# EAGLE design daq (EAGLE 9.6.2)
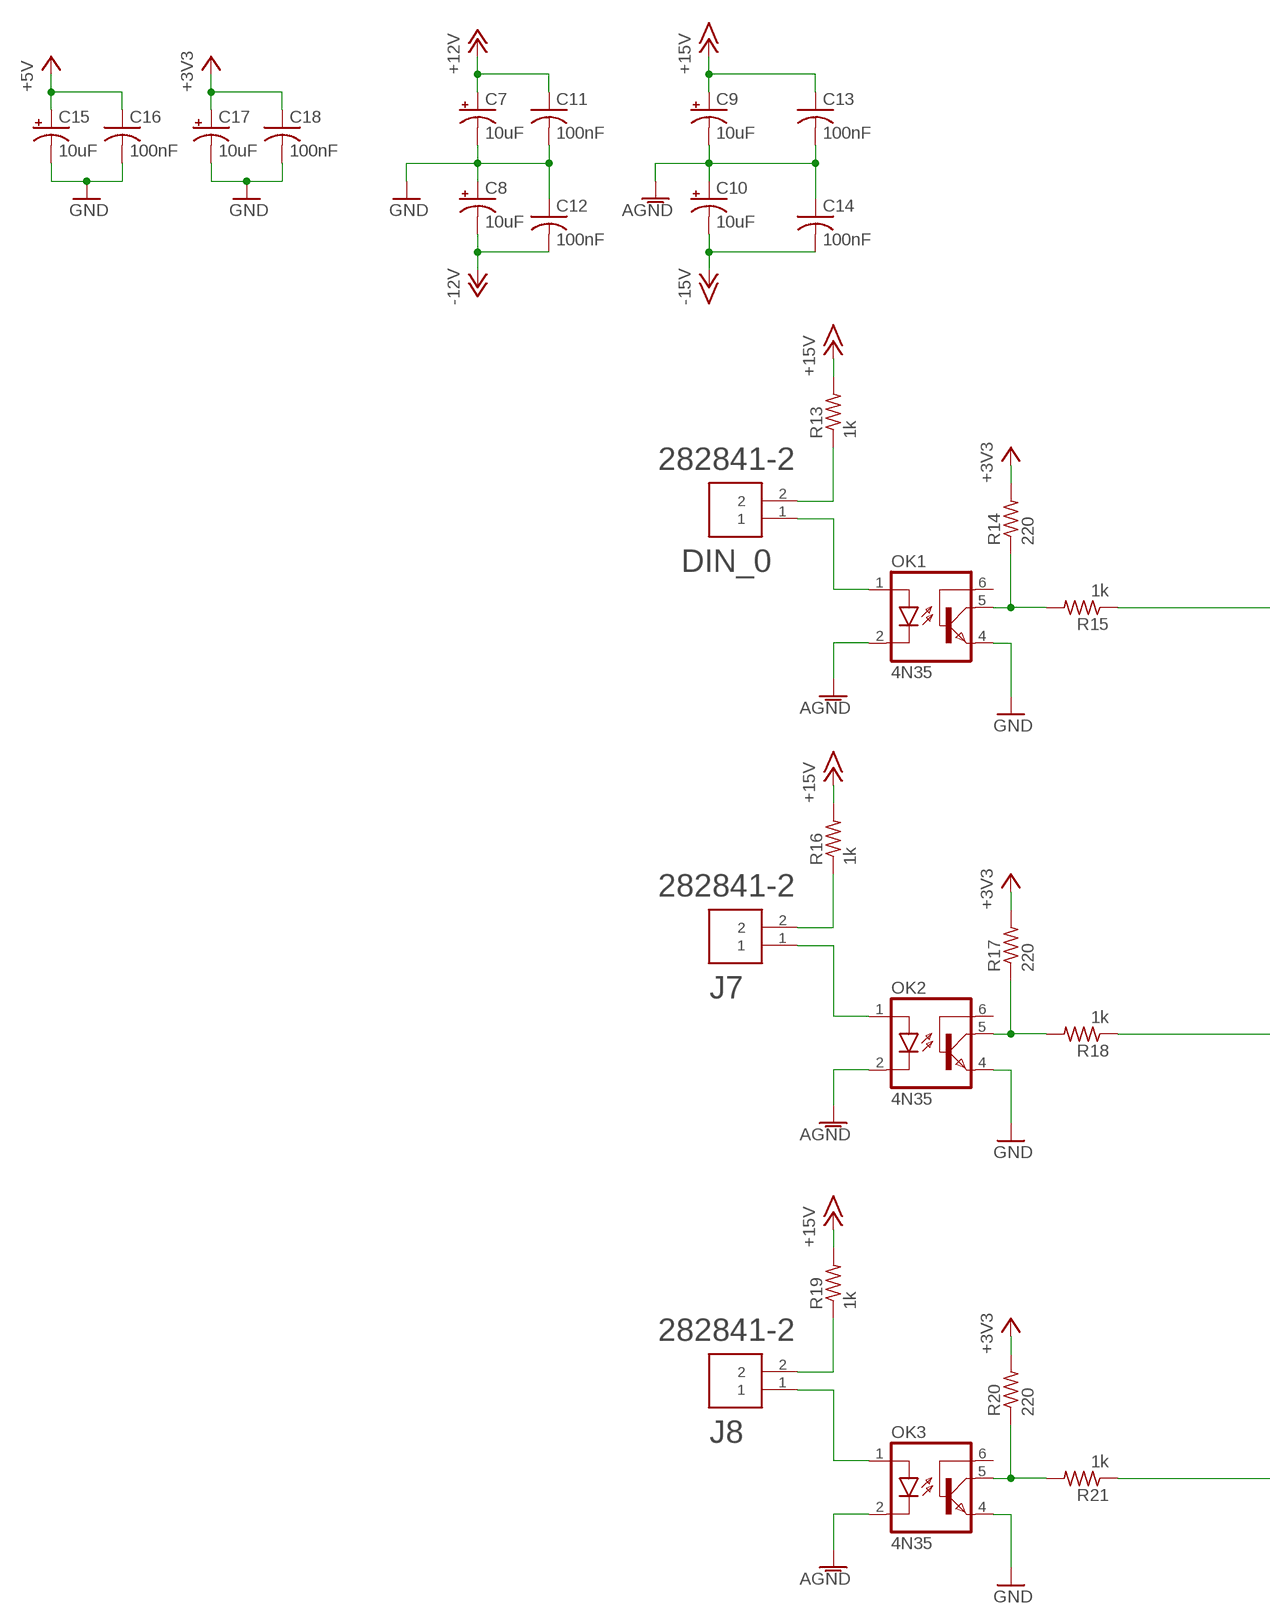
[diagram p0: schematic, sheet 1, part 1 of 2]
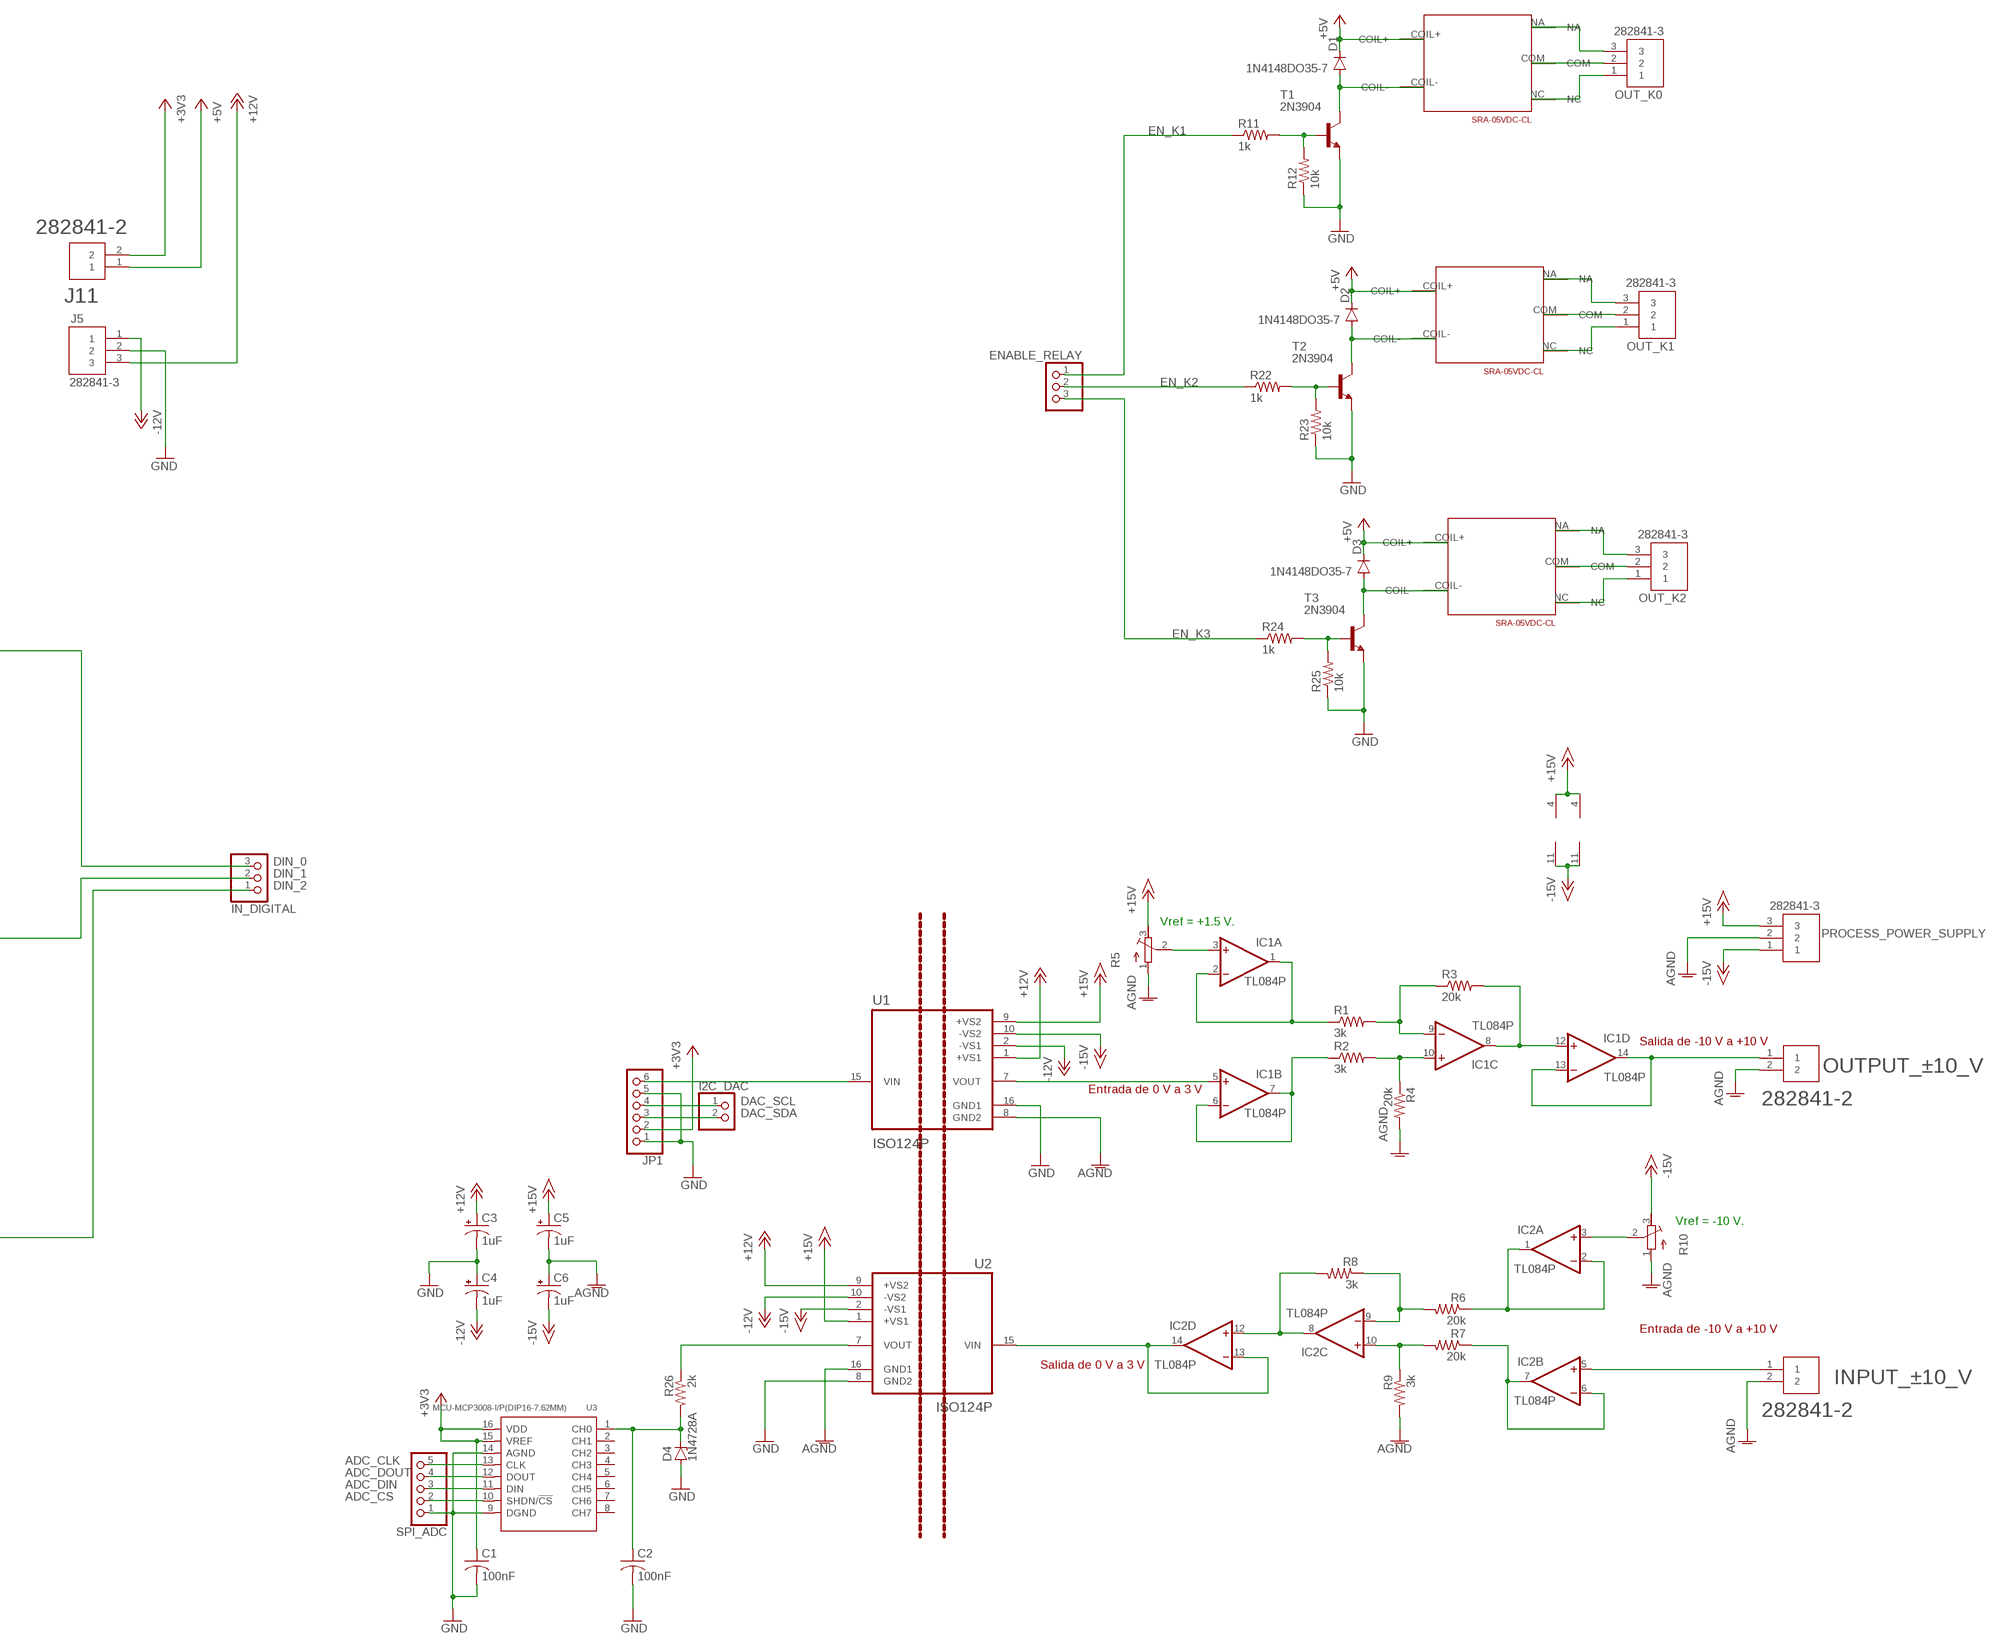
[diagram p1: schematic, sheet 1, part 2 of 2]

## Parts
C1  100nF  C-US025-025X050  [C025-025X050]
C2  100nF  C-US025-025X050  [C025-025X050]
C3  1uF  CPOL-USE2-5  [E2-5]
C4  1uF  CPOL-USE2-5  [E2-5]
C5  1uF  CPOL-USE2-5  [E2-5]
C6  1uF  CPOL-USE2-5  [E2-5]
C7  10uF  CPOL-USE2-5  [E2-5]
C8  10uF  CPOL-USE2-5  [E2-5]
C9  10uF  CPOL-USE2-5  [E2-5]
C10  10uF  CPOL-USE2-5  [E2-5]
C11  100nF  C-US025-025X050  [C025-025X050]
C12  100nF  C-US025-025X050  [C025-025X050]
C13  100nF  C-US025-025X050  [C025-025X050]
C14  100nF  C-US025-025X050  [C025-025X050]
C15  10uF  CPOL-USE2-5  [E2-5]
C16  100nF  C-US025-025X050  [C025-025X050]
C17  10uF  CPOL-USE2-5  [E2-5]
C18  100nF  C-US025-025X050  [C025-025X050]
D1  1N4148DO35-7  [DO35-7]
D2  1N4148DO35-7  [DO35-7]
D3  1N4148DO35-7  [DO35-7]
D4  1N4728A  ZENER-DIODEDO41Z10  [DO41Z10]
DIN_0  282841-2  [TE_282841-2]
ENABLE_RELAY  PINHD-1X3  [1X03]
I2C_DAC  PINHD-1X2  [1X02]
IC1  TL084P  [DIL14]
IC2  TL084P  [DIL14]
IN_DIGITAL  PINHD-1X3  [1X03]
INPUT_±10_V  282841-2  [TE_282841-2]
J5  282841-3  [TE_282841-3]
J7  282841-2  [TE_282841-2]
J8  282841-2  [TE_282841-2]
J11  282841-2  [TE_282841-2]
JP1  PINHD-1X6  [1X06]
OK1  4N35  [DIL06]
OK2  4N35  [DIL06]
OK3  4N35  [DIL06]
OUT_K0  282841-3  [TE_282841-3]
OUT_K1  282841-3  [TE_282841-3]
OUT_K2  282841-3  [TE_282841-3]
OUTPUT_±10_V  282841-2  [TE_282841-2]
PROCESS_POWER_SUPPLY  282841-3  [TE_282841-3]
R1  3k  R-US_0207/10  [0207/10]
R2  3k  R-US_0207/10  [0207/10]
R3  20k  R-US_0207/10  [0207/10]
R4  20k  R-US_0207/10  [0207/10]
R5  R-TRIMM64W  [RTRIM64W]
R6  20k  R-US_0207/10  [0207/10]
R7  20k  R-US_0207/10  [0207/10]
R8  3k  R-US_0207/10  [0207/10]
R9  3k  R-US_0207/10  [0207/10]
R10  R-TRIMM64W  [RTRIM64W]
R11  1k  R-US_0207/10  [0207/10]
R12  10k  R-US_0207/10  [0207/10]
R13  1k  R-US_0207/10  [0207/10]
R14  220  R-US_0207/10  [0207/10]
R15  1k  R-US_0207/10  [0207/10]
R16  1k  R-US_0207/10  [0207/10]
R17  220  R-US_0207/10  [0207/10]
R18  1k  R-US_0207/10  [0207/10]
R19  1k  R-US_0207/10  [0207/10]
R20  220  R-US_0207/10  [0207/10]
R21  1k  R-US_0207/10  [0207/10]
R22  1k  R-US_0207/10  [0207/10]
R23  10k  R-US_0207/10  [0207/10]
R24  1k  R-US_0207/10  [0207/10]
R25  10k  R-US_0207/10  [0207/10]
R26  2k  R-US_0207/10  [0207/10]
SPI_ADC  PINHD-1X5  [1X05]
T1  2N3904  [TO92]
T2  2N3904  [TO92]
T3  2N3904  [TO92]
U1  ISO124P  [DIP763W46P254L2134H533Q8_16]
U2  ISO124P  [DIP763W46P254L2134H533Q8_16]
U3  MCU-MCP3008-I/P(DIP16-7.62MM)  [DIP16-2.54-19.2X7.62MM]
U$1  SRA-05VDC-CL  [SRA-05VDC-CL]
U$2  SRA-05VDC-CL  [SRA-05VDC-CL]
U$3  SRA-05VDC-CL  [SRA-05VDC-CL]

## Nets
+3V3: C1.1 C17.+ C18.1 J11.2 JP1.2 R14.2 R17.2 R20.2 U3.15(VREF) U3.16(VDD)
+5V: C15.+ C16.1 D1.C D2.C D3.C J11.1 U$1.COIL+ U$2.COIL+ U$3.COIL+
+12V: C3.+ C7.+ C11.1 J5.3 U1.1(+VS1) U2.9(+VS2)
+15V: C5.+ C9.+ C13.1 IC1.4(P:V+) IC2.4(P:V+) PROCESS_POWER_SUPPLY.3 R5.3(E) R13.2 R16.2 R19.2 U1.9(+VS2) U2.1(+VS1)
-12V: C4.- C8.- C12.2 J5.1 U1.2(-VS1) U2.10(-VS2)
-15V: C6.- C10.- C14.2 IC1.11(P:V-) IC2.11(P:V-) PROCESS_POWER_SUPPLY.1 R10.3(E) U1.10(-VS2) U2.2(-VS1)
ADC_CLK: SPI_ADC.5 U3.13(CLK)
ADC_CS: SPI_ADC.2 U3.10(SHDN/!CS)
ADC_DIN: SPI_ADC.3 U3.11(DIN)
ADC_DOUT: SPI_ADC.4 U3.12(DOUT)
AGND: C5.- C6.+ C9.- C10.+ C13.2 C14.1 INPUT_±10_V.2 OK1.2(C) OK2.2(C) OK3.2(C) OUTPUT_±10_V.2 PROCESS_POWER_SUPPLY.2 R4.2 R5.1(A) R9.2 R10.1(A) U1.8(GND2) U2.16(GND1)
DAC_SCL: I2C_DAC.1 JP1.4
DAC_SDA: I2C_DAC.2 JP1.3
DIN_0: IN_DIGITAL.3 R15.1
DIN_1: IN_DIGITAL.2 R18.1
DIN_2: IN_DIGITAL.1 R21.1
EN_K1: ENABLE_RELAY.1 R11.1
EN_K2: ENABLE_RELAY.2 R22.1
EN_K3: ENABLE_RELAY.3 R24.1
GND: C1.2 C2.2 C3.- C4.+ C7.- C8.+ C11.2 C12.1 C15.- C16.2 C17.- C18.2 D4.A J5.2 JP1.1 JP1.5 OK1.4(EMI) OK2.4(EMI) OK3.4(EMI) R12.1 R23.1 R25.1 SPI_ADC.1 T1.3(E) T2.3(E) T3.3(E) U1.16(GND1) U2.8(GND2) U3.9(DGND) U3.14(AGND)
N$1: IC1.9(C:-IN) R1.2 R3.1
N$2: IC1.10(C:+IN) R2.2 R4.1
N$3: IC1.1(A:OUT) IC1.2(A:-IN) R1.1
N$4: IC1.8(C:OUT) IC1.12(D:+IN) R3.2
N$5: IC1.6(B:-IN) IC1.7(B:OUT) R2.1
N$6: IC1.13(D:-IN) IC1.14(D:OUT) OUTPUT_±10_V.1
N$7: IC1.3(A:+IN) R5.2(S)
N$8: IC2.9(C:-IN) R6.2 R8.1
N$9: IC2.10(C:+IN) R7.2 R9.1
N$10: IC2.8(C:OUT) IC2.12(D:+IN) R8.2
N$11: IC2.1(A:OUT) IC2.2(A:-IN) R6.1
N$12: IC2.6(B:-IN) IC2.7(B:OUT) R7.1
N$13: IC2.13(D:-IN) IC2.14(D:OUT) U2.15(VIN)
N$14: IC2.3(A:+IN) R10.2(S)
N$15: IC1.5(B:+IN) U1.7(VOUT)
N$16: IC2.5(B:+IN) INPUT_±10_V.1
N$17: C2.1 D4.C R26.2 U3.1(CH0)
N$18: JP1.6 U1.15(VIN)
N$19: D1.A T1.1(C) U$1.COIL-
N$20: R11.2 R12.2 T1.2(B)
N$21: OUT_K0.3 U$1.NA
N$22: OUT_K0.2 U$1.COM
N$23: OUT_K0.1 U$1.NC
N$24: DIN_0.1 OK1.1(A)
N$25: DIN_0.2 R13.1
N$26: OK1.5(COL) R14.1 R15.2
N$27: J7.1 OK2.1(A)
N$28: J7.2 R16.1
N$29: OK2.5(COL) R17.1 R18.2
N$30: J8.1 OK3.1(A)
N$31: J8.2 R19.1
N$32: OK3.5(COL) R20.1 R21.2
N$33: D2.A T2.1(C) U$2.COIL-
N$34: OUT_K1.3 U$2.NA
N$35: OUT_K1.2 U$2.COM
N$36: OUT_K1.1 U$2.NC
N$37: R22.2 R23.2 T2.2(B)
N$38: D3.A T3.1(C) U$3.COIL-
N$39: OUT_K2.3 U$3.NA
N$40: OUT_K2.2 U$3.COM
N$41: OUT_K2.1 U$3.NC
N$42: R24.2 R25.2 T3.2(B)
N$45: R26.1 U2.7(VOUT)
Unconnected: OK1.6(BAS) OK2.6(BAS) OK3.6(BAS) U3.2(CH1) U3.3(CH2) U3.4(CH3) U3.5(CH4) U3.6(CH5) U3.7(CH6) U3.8(CH7)

## Notes on the sheet
- Vref = +1.5 V.
- Salida de -10 V a +10 V
- Entrada de 0 V a 3 V
- Vref = -10 V.
- Entrada de -10 V a +10 V
- Salida de 0 V a 3 V

## Library data of the parts
C1 C2 C11-C14 C16 C18 = rcl:C-US: CAPACITOR, American symbol; SPICEPREFIX: C
C3-C10 C15 C17 = rcl:CPOL-US: POLARIZED CAPACITOR, American symbol; SPICEPREFIX: C
D1-D3 = diode:1N4148: DIODE high speed (Philips)
D4 = diode:ZENER-DIODE: Z-Diode
DIN_0 INPUT_±10_V J7 J8 J11 OUTPUT_±10_V = 282841-2:282841-2: TERM BLOCK 2POS SIDE ENT 5.08MM Check prices <https://pricing.snapeda.com/parts/282841-2/TE%20Connectivity/view-part?ref=eda>; AVAILABILITY: In Stock; COMMENT: 282841-2; DESCRIPTION: Conn Terminal Block 2 POS 5.08mm Solder ST Thru-Hole 17.5A/Contact; EU_ROHS_COMPLIANCE: Compliant with Exemptions; MF: TE Connectivity; MP: 282841-2; PACKAGE: None; PRICE: None; PURCHASE-URL: https://pricing.snapeda.com/search/part/282841-2/?ref=eda
ENABLE_RELAY IN_DIGITAL = pinhead:PINHD-1X3: PIN HEADER
I2C_DAC = pinhead:PINHD-1X2: PIN HEADER
IC1 IC2 = linear:TL084: OP AMP
J5 OUT_K0 OUT_K1 OUT_K2 PROCESS_POWER_SUPPLY = 282841-3:282841-3: TERM BLOCK 3POS SIDE ENT 5.08MM Check prices <https://pricing.snapeda.com/parts/282841-3/TE%20Connectivity/view-part?ref=eda>; AVAILABILITY: In Stock; COMMENT: 282841-3; DESCRIPTION: Conn Terminal Block 3 POS 5.08mm Solder ST Thru-Hole 17.5A/Contact; EU_ROHS_COMPLIANCE: Compliant with Exemptions; MF: TE Connectivity; MP: 282841-3; PACKAGE: None; PRICE: None; PURCHASE-URL: https://pricing.snapeda.com/search/part/282841-3/?ref=eda
JP1 = pinhead:PINHD-1X6: PIN HEADER
OK1-OK3 = optocoupler:4N35: MOTOROLA OPTO COUPLER; MF: FAIRCHILD SEMICONDUCTOR; MPN: 4N35; OC_FARNELL: 1328375; OC_NEWARK: 72K9946
R1-R4 R6-R9 R11-R26 = rcl:R-US_: RESISTOR, American symbol; SPICEPREFIX: R
R5 R10 = rcl:R-TRIMM: Trimm resistor; SPICEMODEL: X; SPICEPREFIXL: POT
SPI_ADC = pinhead:PINHD-1X5: PIN HEADER
T1-T3 = transistor:2N3904: NPN TRANSISTOR
U1 U2 = ISO124P:ISO124P: Check availability <https://pricing.snapeda.com/parts/ISO124P/Rochester%20Electronics%2C%20LLC/view-part?ref=eda>; AVAILABILITY: Not in stock; DESCRIPTION: SP Amp ISOL Amp Single ±18V 8-Pin PDIP Tube; MF: Rochester Electronics, LLC; MP: ISO124P; PACKAGE: None; PRICE: None
U3 = MCP3008-I_P_DIP16-7.62MM_:MCU-MCP3008-I/P(DIP16-7.62MM): 310990040 Check availability <https://pricing.snapeda.com/parts/MCP3008-I/P/Microchip%20Technology/view-part?ref=eda>; AVAILABILITY: In Stock; DESCRIPTION: 10 Bit Analog to Digital Converter 4, 8 Input 1 SAR 16-PDIP; MF: Microchip Technology; MP: MCP3008-I/P; PACKAGE: None; PRICE: None; PURCHASE-URL: https://pricing.snapeda.com/search/part/MCP3008-I/P/?ref=eda
U$1-U$3 = SRA-05VDC-CL:SRA-05VDC-CL

## Board
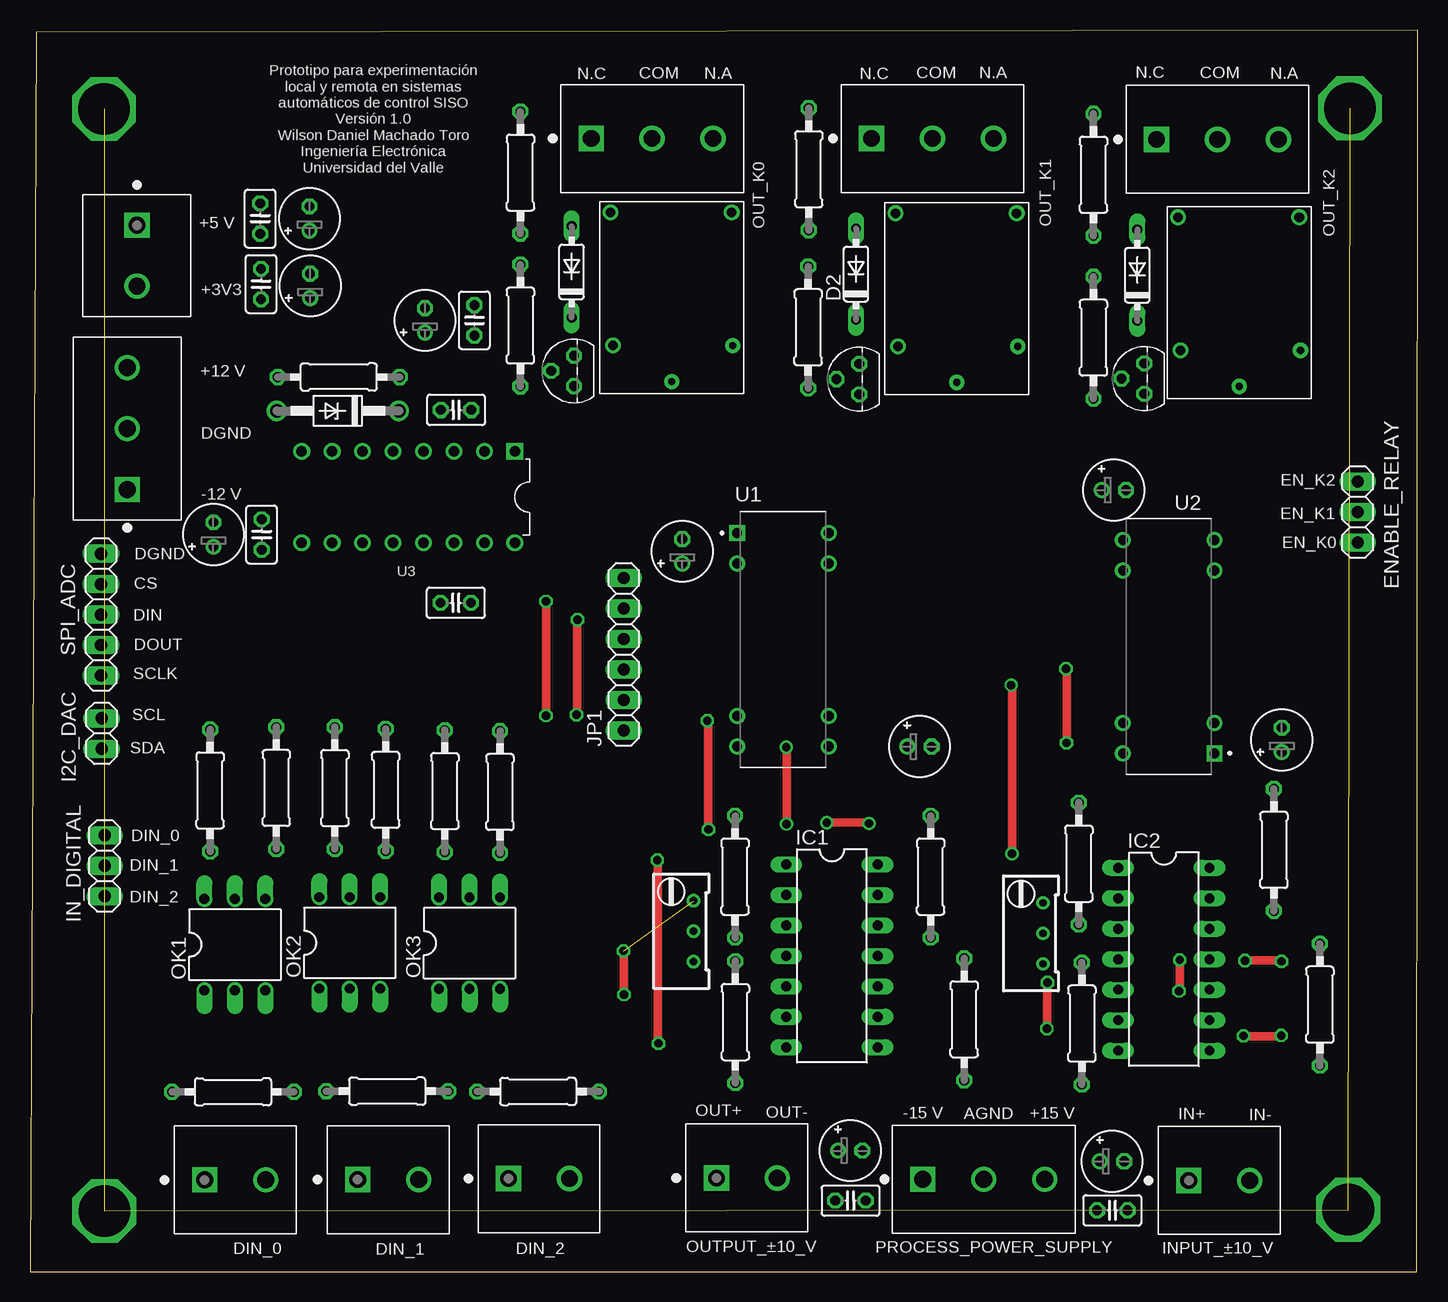
[diagram p2: board, top side]
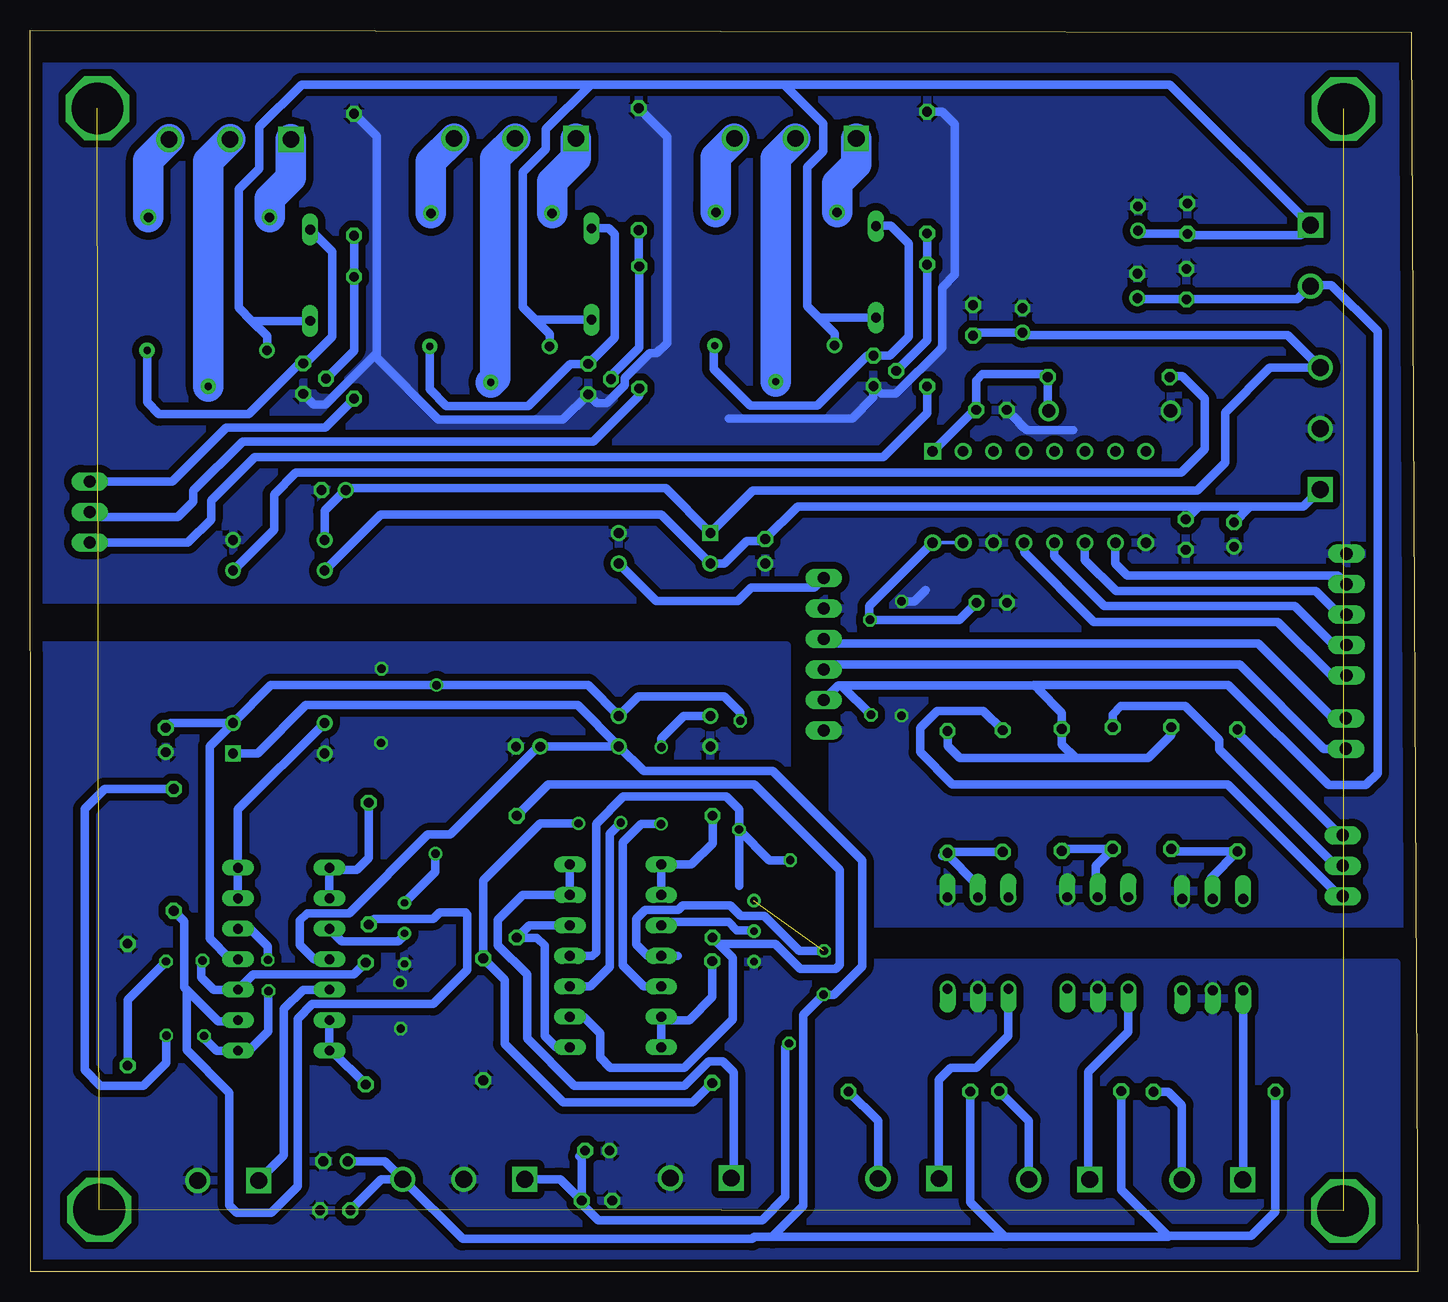
[diagram p3: board, bottom side, seen from below]

Size 115.63 x 103.53 mm. Coordinates in mm from the lower left corner, seen from the top.
Outline: 0,0 115.58,0.03 115.63,103.53 0.53,103.33 0,0
Copper layers (1*16): Top 0.035mm / dielectric 1.5mm / Bottom 0.035mm
Design rules "default": minimum track width 6mil, minimum drill 0.35mm, track to track 6mil, track to pad 6mil, pad to pad 6mil, via to via 6mil, smd to smd 6mil, copper to edge 40mil, drill to drill 6mil, minimum pad ring 10mil, minimum via ring 8mil, stop-mask expansion 4mil, vias tented up to drill 0mil, thermal gap 10mil

### Footprints (pad centres in the part's own frame; a part is rotated, then mirrored left to right if it is on the bottom)
C025-025X050 = drill 0.813 octagon: 1 -1.27,0; 2 1.27,0
E2-5 = drill 0.813 pad 1.27: + -1.016,0 | drill 0.813 pad 1.27 octagon: - 1.016,0
DO35-7 = drill 0.813 long: A 3.81,0; C -3.81,0
DO41Z10 = drill 1.118: A 5.08,0; C -5.08,0
TE_282841-2 = drill 1.4 square: 1 -2.54,0 | drill 1.4: 2 2.54,0
1X03 = drill 1.016 long: 1 -2.54,0; 2 0,0; 3 2.54,0
1X02 = drill 1.016 long: 1 -1.27,0; 2 1.27,0
DIL14 = drill 0.813 long: 1 -7.62,-3.81; 2 -5.08,-3.81; 3 -2.54,-3.81; 4 0,-3.81; 5 2.54,-3.81; 6 5.08,-3.81; 7 7.62,-3.81; 8 7.62,3.81; 9 5.08,3.81; 10 2.54,3.81; 11 0,3.81; 12 -2.54,3.81; 13 -5.08,3.81; 14 -7.62,3.81
TE_282841-3 = drill 1.4 square: 1 -5.08,0 | drill 1.4: 2 0,0; 3 5.08,0
1X06 = drill 1.016 long: 1 -6.35,0; 2 -3.81,0; 3 -1.27,0; 4 1.27,0; 5 3.81,0; 6 6.35,0
DIL06 = drill 0.813 offset: 1 -2.54,-3.81; 2 0,-3.81; 3 2.54,-3.81; 4 2.54,3.81; 5 0,3.81; 6 -2.54,3.81
0207/10 = drill 0.813 octagon: 1 -5.08,0; 2 5.08,0
RTRIM64W = drill 0.61: 1 1.27,-2.54; 2 1.27,0; 3 1.27,2.54
1X05 = drill 1.016 long: 1 -5.08,0; 2 -2.54,0; 3 0,0; 4 2.54,0; 5 5.08,0
TO92 = drill 0.813 octagon: 1 1.27,0; 2 0,1.905; 3 -1.27,0
DIP763W46P254L2134H533Q8_16 = drill 0.82 pad 1.23 square: 1 -3.815,8.89 | drill 0.82 pad 1.23: 2 -3.815,6.35; 7 -3.815,-6.35; 8 -3.815,-8.89; 9 3.815,-8.89; 10 3.815,-6.35; 15 3.815,6.35; 16 3.815,8.89
DIP16-2.54-19.2X7.62MM = drill 0.9 pad 1.4 square: 1 -8.89,-3.81 | drill 0.9 pad 1.4: 2 -6.35,-3.81; 3 -3.81,-3.81; 4 -1.27,-3.81; 5 1.27,-3.81; 6 3.81,-3.81; 7 6.35,-3.81; 8 8.89,-3.81; 9 8.89,3.81; 10 6.35,3.81; 11 3.81,3.81; 12 1.27,3.81; 13 -1.27,3.81; 14 -3.81,3.81; 15 -6.35,3.81; 16 -8.89,3.81
SRA-05VDC-CL = drill 0.8 pad 1.27: COIL+ 1.1,4; NA 11,15.1; NC 0.9,15.1 | drill 0.6 pad 1.27: COIL- 11.1,4; COM 6,1

### Placement (x,y rotation side)
C1  35.48,55.78 180 top
C2  35.51,71.86 180 top
C3  90.32,65.18 0 top
C4  54.36,60.07 90 top
C5  74.12,43.79 0 top
C6  104.32,44.35 90 top
C7  32.92,79.32 90 top
C8  15.29,61.47 90 top
C9  90.17,9.22 0 top
C10  68.35,10.11 0 top
C11  37.03,79.32 90 top
C12  19.3,61.47 90 top
C13  90.2,5.13 0 top
C14  68.38,5.94 0 top
C15  23.29,87.81 90 top
C16  19.18,87.81 90 top
C17  23.34,82.19 90 top
C18  19.25,82.35 90 top
D1  45.14,83.36 90 top
D2  68.83,83.19 90 top
D3  92.28,83.08 90 top
D4  25.65,71.78 180 top
DIN_0  17.09,7.67 0 top
ENABLE_RELAY  110.64,63.35 90 top
I2C_DAC  5.97,44.88 270 top
IC1  66.83,26.34 270 top
IC2  94.49,26.06 270 top
IN_DIGITAL  6.22,33.86 90 top
INPUT_±10_V  99.11,7.62 0 top
J5  8.1,70.31 90 top
J7  29.84,7.7 0 top
J8  42.42,7.77 0 top
J11  8.92,84.71 270 top
JP1  49.48,51.49 90 top
OK1  17.07,27.28 0 top
OK2  26.64,27.43 0 top
OK3  36.63,27.41 0 top
OUT_K0  51.84,94.49 0 top
OUT_K1  75.21,94.49 0 top
OUT_K2  98.96,94.41 0 top
OUTPUT_±10_V  59.74,7.82 0 top
PROCESS_POWER_SUPPLY  79.48,7.72 0 top
R1  58.75,32.94 270 top
R2  58.78,20.83 270 top
R3  75.06,32.94 270 top
R4  77.85,21.06 270 top
R5  54.03,28.4 0 top
R6  87.4,34.04 270 top
R7  87.66,20.7 90 top
R8  103.66,35.18 90 top
R9  107.49,22.28 90 top
R10  83.16,28.22 0 top
R11  40.87,78.89 90 top
R12  40.87,91.64 270 top
R13  16.92,15.01 180 top
R14  20.52,40.34 90 top
R15  15.01,40.13 270 top
R16  29.77,15.06 180 top
R17  29.64,40.18 90 top
R18  25.4,40.34 270 top
R19  42.34,15.04 180 top
R20  39.17,40.01 90 top
R21  34.57,40.08 270 top
R22  64.85,78.74 90 top
R23  64.9,91.92 270 top
R24  88.62,77.88 90 top
R25  88.62,91.47 270 top
R26  25.73,74.6 0 top
SPI_ADC  5.92,54.79 270 top
T1  45.34,75.11 90 top
T2  69.11,74.42 90 top
T3  92.86,74.47 90 top
U1  62.74,52.7 0 top
U2  94.89,52.12 180 top
U3  31.52,64.59 180 top
U$1  47.47,73.23 0 top
U$2  71.22,73.15 0 top
U$3  94.77,72.82 0 top

### Tracks (layer width: path | path; a pad name or v marks a point on that pad's centre or on a via)
+3V3  (via drill 0.7)
  Top 0.7: v45.54,46.43 45.62,46.51 v45.62,54.36
  Bottom 0.152: C1.1 36.73,55.8
  Bottom 0.305: U3.15 U3.16
  Bottom 0.7: R14.2 20.52,44.75 22.45,42.82 28.5,42.82 | 28.5,42.82 29.64,43.97 R17.2 29.64,46.61 31.62,48.59 31.93,48.9 | R20.2 39.17,43.84 38.15,42.82 28.5,42.82 | 31.93,48.9 31.98,48.95 15.77,48.95 7.42,40.59 4.29,40.59 3.33,41.56 3.33,78.41 7.19,82.27 8.81,82.27 J11.2 10.01,81.08 C18.1 23.24,81.08 C17.+ | 31.93,48.9 48.01,48.9 | JP1.2 48.26,48.9 48.01,48.9 | U3.16 45.69,55.5 45.69,54.38 45.67,54.36 v45.62,54.36 38.18,54.36 36.73,55.8 | v45.54,46.43 48.01,48.9
+5V
  Bottom 0.7: 52.78,98.98 49.5,95.71 49.5,93.45 50.85,92.1 50.85,80.49 49.91,79.55 | 52.78,98.98 68.91,98.98 | 68.91,98.98 72.63,95.26 72.63,93.61 74.55,91.69 74.55,80.42 73.51,79.38 | 68.91,98.98 92.99,98.98 96.52,95.45 96.52,91.97 98.25,90.25 98.25,80.39 97.13,79.27 | 52.78,98.98 20.65,98.98 J11.1 9.73,86.44 19.08,86.44 C16.1 23.04,86.54 C15.+ | D1.C 49.91,79.55 | U$1.COIL+ 48.57,78.21 49.91,79.55 | D2.C 73.51,79.38 | U$2.COIL+ 72.32,78.19 73.51,79.38 | D3.C 97.13,79.27 | U$3.COIL+ 95.87,78.01 97.13,79.27
+12V
  Bottom 0.7: U2.9 91.08,63.45 89.2,65.33 | 89.2,65.33 62.66,65.33 U1.1 55.39,65.13 18.36,65.13 16.03,67.46 16.03,71.65 12.29,75.39 J5.3 10.79,78.08 32.69,78.08 C7.+ 36.78,78.31 C11.1 | C3.+ 89.2,65.28 89.2,65.33
+15V  (via drill 0.7)  (1 unrouted)
  Top 0.7: v49.49,23.13 49.49,26.71 49.45,26.75 v49.47,26.76
  Bottom 0.305: IC2.4 91.29,26.06
  Bottom 0.7: PROCESS_POWER_SUPPLY.3 79.58,2.74 55.45,2.74 55.27,2.92 53.77,2.92 | 53.77,2.92 51.18,5.51 51.18,21.44 v49.49,23.13 49.45,23.09 48.65,23.09 46.28,25.46 46.28,34.29 53.75,41.76 64.5,41.76 U1.9 | v49.47,26.76 51.52,26.76 54.43,29.67 56.39,29.67 57.25,30.53 61.24,30.53 61.59,30.18 64.36,30.18 65.1,29.44 65.1,27.31 64.13,26.34 IC1.4 61.65,26.34 | R13.2 11.84,5.03 13.87,3 20.83,3 | 34.39,2.92 20.75,2.92 20.83,3 | 34.39,2.92 37.26,5.79 R19.2 | R16.2 24.69,6.86 20.83,3 | IC2.4 91.92,26.06 93.14,27.28 93.14,29.29 92.53,29.9 89.03,29.9 82.48,36.45 80.62,36.45 73.18,43.89 73.1,43.82 C5.+ 73.08,43.82 U1.9 | 66.63,43.89 U1.9 | U2.1 96.65,43.23 92.63,47.24 69.98,47.24 U1.9 | 34.39,2.92 53.77,2.92 | PROCESS_POWER_SUPPLY.3 86.06,9.22 C9.+ | C13.1 86.33,7.72 PROCESS_POWER_SUPPLY.3
-12V
  Bottom 0.305: U2.10 90.98,58.47
  Bottom 0.7: J5.1 9.52,63.8 13.97,63.8 | 13.97,63.8 18.24,63.8 | 18.24,63.8 51.66,63.8 54.38,61.09 | U2.10 86.41,63.14 63.01,63.14 U1.2 57.78,59.06 55.91,60.93 54.54,60.93 54.38,61.09 | C4.- 54.38,61.09 | C8.- 13.97,63.8 | C12.2 18.24,63.8
-15V  (via drill 0.7)
  Top 0.7: v52.27,34.32 52.32,34.26 52.32,19.1 v52.37,19.05 52.4,19.02 | v56.54,36.88 56.54,45.95 v56.44,45.95 | v81.84,34.87 81.84,48.92 v81.76,48.92
  Bottom 0.7: IC1.11 68.76,26.34 68.45,26.64 68.45,37.36 66.19,39.62 57.61,39.62 56.54,38.56 v56.54,36.88 56.54,36.83 | PROCESS_POWER_SUPPLY.1 71.68,7.72 71.42,7.72 C14.2 | v52.27,34.32 54.03,34.32 56.54,36.83 | v56.44,45.95 56.44,46.63 57.76,47.96 64.95,47.96 U1.10 69.12,48.92 v81.76,48.92 95.56,48.92 U2.2 | IC2.11 98.93,26.06 100.66,27.79 100.66,43.82 U2.2 | 56.54,32.18 56.54,36.83 | v52.37,19.05 52.68,18.75 52.68,6.25 54.61,4.32 68.28,4.32 69.65,5.69 C14.2 | U2.2 103.91,45.77 C6.- | 69.84,9.64 C10.- 69.65,9.83 C14.2 | R10.3 81.84,33.35 v81.84,34.87
ADC_CLK
  Bottom 0.7: U3.13 32.79,59.99 26.97,54.18 11.63,54.18 7.16,49.71 SPI_ADC.5
ADC_CS
  Bottom 0.7: U3.10 25.17,59.06 24.18,58.06 6.65,58.06 SPI_ADC.2
ADC_DIN
  Bottom 0.7: U3.11 27.71,59.36 25.1,56.74 8.48,56.74 6.53,54.79 SPI_ADC.3
ADC_DOUT
  Bottom 0.7: U3.12 30.25,59.66 26.11,55.52 10.24,55.52 6.96,52.25 SPI_ADC.4
AGND  (via drill 0.7)
  Top 0.7: v86.39,44.09 86.39,50.29 86.36,50.32 v86.33,50.29 | v84.79,24.13 84.79,20.37 84.81,20.35 v84.73,20.27
  Bottom 0.7: v86.33,50.29 86.44,50.39 86.49,50.39 | v84.73,20.27 84.73,20.19 84.84,20.09
  pour Bottom (isolate 0.61): 1.75,0.15 1.75,25.76 52.55,25.76 52.55,52.22 114.78,52.22 114.78,0.15
DAC_SCL
  Bottom 0.7: I2C_DAC.1 7.01,46.15 13.26,52.4 49.12,52.4 JP1.4
DAC_SDA
  Bottom 0.7: I2C_DAC.2 7.82,43.61 14.83,50.62 49.07,50.62 JP1.3
DIN_0
  Bottom 0.7: IN_DIGITAL.3 6.45,36.4 15.01,44.96 R15.1
DIN_1
  Bottom 0.7: IN_DIGITAL.2 6.83,33.86 16.54,43.56 16.54,44.35 19.35,47.17 24.71,47.17 25.4,46.48 R18.1
DIN_2
  Bottom 0.7: R21.1 36.17,46.76 40.03,46.76 41.45,45.34 41.45,43.33 38.76,40.64 15.8,40.64 6.35,31.19 IN_DIGITAL.1
EN_K1
  Bottom 0.7: R11.1 40.87,71.58 44.53,67.92 96.9,67.92 100.53,64.29 100.53,62.74 102.46,60.81 ENABLE_RELAY.1
EN_K2
  Bottom 0.7: 64.69,73.53 64.82,73.66 R22.1 64.85,73.05 68.68,69.22 97.92,69.22 102.01,65.13 102.01,64.24 103.33,62.92 110.21,62.92 ENABLE_RELAY.2
EN_K3
  Bottom 0.7: R24.1 91.03,70.38 99.26,70.38 103.76,65.89 ENABLE_RELAY.3
GND  (via drill 0.7)
  Top 0.7: v43,46.38 43,55.85 42.98,55.88 v42.99,55.89
  Bottom 0.7: R12.1 39.6,96.72 38.56,95.68 38.56,83.13 39.62,82.07 39.62,77.06 43.48,73.2 44.7,73.2 T1.3 45.34,72.92 47.12,71.15 57.4,71.15 | R23.1 62.53,94.64 62.53,77.44 63.39,76.59 | 63.14,76.89 63.41,76.62 63.39,76.59 | R25.1 86.74,94.67 86.74,76.58 | 86.74,76.58 91.01,72.31 91.97,72.31 T3.3 | 86.74,76.58 86.74,76.2 81.58,71.04 71.22,71.04 T2.3 68.38,72.42 67.57,72.42 66.05,73.94 66.05,74.52 63.97,76.59 63.39,76.59 | v42.99,55.89 41.92,55.89 40.97,56.85 | 32.92,70.44 33.25,70.76 33.25,70.87 C2.2 32.56,70.18 28.68,70.18 | JP1.5 49.45,55.27 48.82,55.27
  pour Bottom (isolate 0.61): 0.48,29.03 48.74,29.03 48.74,56.03 114.78,56.03 114.78,100.48 0.48,100.48
N$1
  Bottom 0.7: R3.1 72.44,40.64 55.27,40.64 48.13,33.5 48.13,25.6 48.49,25.25 51.43,25.25 53.52,27.33 58.22,27.33 R1.2 57.07,26.19 57.07,21.03 61.09,17.02 67.26,17.02 68.12,17.88 68.12,19.89 69.49,21.26 IC1.9 69.62,21.26
N$2  (via drill 0.7)
  Top 0.7: v66.4,37.44 66.45,37.44 66.47,37.47 69.85,37.47 v69.93,37.39
  Bottom 0.7: 70.69,23.85 IC1.10 68.94,23.8 67.31,25.43 67.31,36.53 v66.4,37.44 | R2.2 60.4,14.12 71.17,14.12 76.07,19.02 76.07,24.36 R4.1 77.85,32.64 73.1,37.39 v69.93,37.39
N$3
  Bottom 0.7: IC1.2 IC1.1 60.53,33.96 58.75,35.74 R1.1
N$4
  Bottom 0.7: IC1.12 74.04,28.88 R3.2 73.38,27.86 72.75,27.23 72.75,19.69 71.78,18.72 IC1.8
N$5
  Bottom 0.7: IC1.7 IC1.6 62.74,20.98 60.71,20.98 58.78,22.91 R2.1
N$6
  Bottom 0.7: IC1.14 IC1.13 74.57,31.42 76.63,29.36 76.63,27.23 74.19,24.79 74.19,19.46 70.26,15.52 61.11,15.52 59.08,17.55 57.91,17.55 57,16.64 57,8.03 OUTPUT_±10_V.1
N$7
  Bottom 0.7: R5.2 55.36,28.46 56.72,28.46 57.42,29.16 62.74,29.16 IC1.3
N$8
  Bottom 0.7: R8.1 102.77,29.21 102.77,23.72 102.57,23.52 | IC2.9 98.37,20.9 99.95,20.9 102.57,23.52 | R6.2 86.92,29.44 82.02,29.44 81.48,29.97 79.32,29.97 79.17,29.82 79.17,25.2 82.04,22.33 92.1,22.33 93.33,21.1 93.33,7.14 95.54,4.92 98.4,4.92 99.01,5.54 99.01,14.94 102.57,18.49 102.57,23.52
N$9  (via drill 0.7)
  Top 0.7: v101.24,25.96 104.29,25.96 v104.29,25.88
  Bottom 0.7: R7.2 88.65,24.79 97.03,24.79 IC2.10 100.3,23.52 101.35,24.56 101.35,25.91 101.3,25.96 v101.24,25.96 | v104.29,25.88 107.49,22.68 R9.1
N$10  (via drill 0.7)
  Top 0.7: v95.76,23.42 95.81,23.47 v95.81,26.01 | v101.13,19.67 101.17,19.63 104.27,19.63 v104.27,19.71
  Bottom 0.7: IC2.12 97.28,28.6 95.81,27.13 v95.81,26.01 | v95.76,23.42 95.76,20.07 97.38,18.44 IC2.8 100.08,18.44 101.22,19.58 v101.13,19.67 | v104.27,19.71 104.27,17.42 106.17,15.52 109.75,15.52 111.07,16.84 111.07,38.58 109.4,40.26 R8.2
N$11
  Bottom 0.7: IC2.2 IC2.1 90.53,33.53 88.39,33.53 87.4,34.52 R6.1
N$12
  Bottom 0.7: R7.1 90.47,18.44 IC2.7 IC2.6
N$13
  Bottom 0.305: IC2.13 98.3,31.01 | 90.98,45.87 U2.15
  Bottom 0.7: IC2.13 IC2.14 98.3,38.55 U2.15
N$14
  Bottom 0.7: R10.2 84.28,28.22 84.94,27.56 89.64,27.56 IC2.3
N$15  (via drill 0.7)
  Top 0.7: v63.02,43.74 63.04,43.71 v63.04,37.34
  Bottom 0.7: IC1.5 64.49,23.8 66.24,25.55 66.24,35.79 64.69,37.34 v63.04,37.34 | U1.7 61.14,46.36 63.02,44.48 v63.02,43.74
N$16
  Bottom 0.7: IC2.5 92.86,23.52 94.46,21.92 94.46,9.73 INPUT_±10_V.1
N$17
  Bottom 0.152: C2.1 36.83,71.91
  Bottom 0.7: 40.34,68.4 U3.1 36.96,71.86 C2.1 36.78,74.32 36.27,74.83 31.04,74.83 R26.2 30.81,71.86 D4.C
N$18
  Bottom 0.7: JP1.6 50.27,57.05 55.52,57.05 56.64,55.93 63.43,55.93 U1.15
N$19
  Bottom 0.7: D1.A 45.08,87.22 43.92,87.22 42.39,85.7 42.39,77.98 43.99,76.38 T1.1 45.85,76.38 50.01,72.21 55.6,72.21 58.65,75.26 58.65,77.15 U$1.COIL-
N$20
  Bottom 0.7: R12.2 R11.2 40.87,77.67 T1.2
N$21
  Bottom 2.54: U$1.NA 58.47,89.2 58.47,92.94 OUT_K0.3
N$22
  Bottom 2.54: U$1.COM 53.47,92.86 OUT_K0.2
N$23
  Bottom 2.54: U$1.NC 48.37,90.74 46.76,92.35 OUT_K0.1
N$24
  Bottom 0.7: OK1.1 14.53,7.7 DIN_0.1
N$25
  Bottom 0.7: DIN_0.2 19.63,13.89 20.75,15.01 R13.1
N$26
  Bottom 0.305: 14.94,35.13 R15.2 15.14,34.93
  Bottom 0.7: R15.2 20.32,35.05 R14.1 | OK1.5 17.25,31.27 17.25,32.82 14.94,35.13
N$27
  Bottom 0.7: 24.26,23.47 OK2.1 24.1,19.99 27.43,16.66 27.43,7.82 J7.1
N$28
  Bottom 0.7: J7.2 32.38,12.6 R16.1
N$29
  Bottom 0.305: 25.35,35.31 R18.2 | 29.62,35.08 R17.1
  Bottom 0.7: 25.43,35.28 R18.2 29.49,35.26 R17.1 | OK2.5 26.82,31.42 26.82,33.83 25.35,35.31
N$30
  Bottom 0.7: OK3.1 34.09,19.69 36.78,16.99 38.91,16.99 39.88,16.03 J8.1
N$31
  Bottom 0.7: J8.2 44.96,12.57 R19.1
N$32
  Bottom 0.7: R21.2 39.32,35 39.37,34.95 | 39.37,34.95 39.62,34.7 39.4,34.7 R20.1 | OK3.5 36.63,32.21 39.37,34.95
N$33
  Bottom 0.7: D2.A 67.39,87 66.9,86.51 66.9,77.9 T2.1 70.61,75.69 74.12,72.19 80.92,72.19 82.32,73.58 U$2.COIL-
N$34
  Bottom 2.54: OUT_K1.3 82.22,92.56 U$2.NA
N$35
  Bottom 2.54: OUT_K1.2 76.87,92.83 76.87,74.51 U$2.COM
N$36
  Bottom 2.54: OUT_K1.1 70.13,92.86 72.12,90.87 U$2.NC
N$37
  Bottom 0.7: R23.2 64.9,83.87 R22.2 64.85,77.06 67.21,74.7 T2.2
N$38
  Bottom 0.7: D3.A 90.45,85.06 90.45,77.95 92.66,75.74 T3.1 93.14,75.74 97.38,71.5 104.88,71.5 105.87,72.49 U$3.COIL-
N$39
  Bottom 0.7: OUT_K2.3 104.04,93.85
  Bottom 2.54: OUT_K2.3 105.77,92.68 U$3.NA
N$40
  Bottom 2.54: U$3.COM 100.77,92.6 OUT_K2.2
N$41
  Bottom 2.54: U$3.NC 95.67,89.45 93.88,91.24 OUT_K2.1
N$42
  Bottom 0.7: R25.2 R24.2 88.62,76.81 T3.2
N$43  (via drill 4.3)  (3 unrouted)
  other vias: 6.2,5.08 109.86,5.18 110.01,97 6.17,96.95
N$45
  Bottom 0.7: U2.7 95.28,61.9 95.28,64.82 93.47,66.62 19.68,66.62 17.73,68.58 17.73,72.8 19.61,74.68 20.57,74.68 R26.1

### Text on the board
tNames: N.C | COM | N.A | N.C | COM | N.A | N.C | COM | N.A | Prototipo para experimentación / local y remota en sistemas / automáticos de control SISO / Versión 1.0 / Wilson Daniel Machado Toro / Ingeniería Electrónica / Universidad del Valle | +5 V | +3V3 | +12 V | DGND | EN_K2 | -12 V | EN_K1 | EN_K0 | DGND | CS | DIN | DOUT | SCLK | SCL | SDA | DIN_0 | DIN_1 | DIN_2 | OUT+ | OUT- | -15 V | AGND | +15 V | IN+ | IN- | DIN_0 | DIN_1 | DIN_2